# Altium schematic sheet Mini_PD.SchDoc
size A4
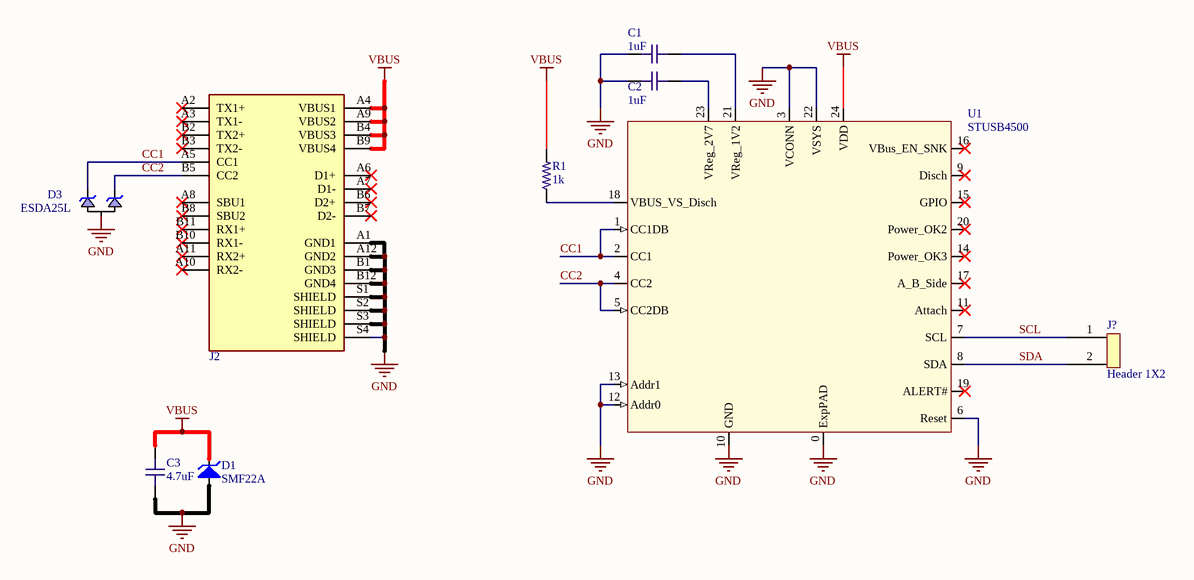
[diagram p0: Mini_PD.SchDoc]

## Parts
C1  value 1uF  [C0402-HIGH-DENSITY]  (hidden comment: C0402 1uF 6.3V X7R)
C2  value 1uF  [C0402-HIGH-DENSITY]  (hidden comment: C0402 1uF 6.3V X7R)
C3  value 4.7uF  [C0603-HIGH-DENSITY]  (hidden comment: 4.7uF, 25V, X5R, 0603)
D1  SMF22A  [SOD-123F]
D3  ESDA25L  [SOT23-3L]
J2  USB C  [Molex USB-C]  (value not drawn)
J?  Header 1X2  [Header 1x2 TH Pitch 2.54mm]
R1  value 1k  [R0402-HIGH-DENSITY]  (hidden comment: R0402 1k 1%)
U1  STUSB4500  [QFN24 - 4X4MM - PITCH 0.5MM - EXPOSEDPAD]

## Nets
GND: C1.1 C2.1 C3.1 D1.A D3.3(A) J2.A1(GND1) J2.A12(GND2) J2.B1(GND3) J2.B12(GND4) J2.S1(SHIELD) J2.S2(SHIELD) J2.S3(SHIELD) J2.S4(SHIELD) U1.0(ExpPAD) U1.3(VCONN) U1.6(Reset) U1.10(GND) U1.12(Addr0) U1.13(Addr1) U1.22(VSYS)
VBUS: C3.2 D1.K J2.A4(VBUS1) J2.A9(VBUS2) J2.B4(VBUS3) J2.B9(VBUS4) R1.2 U1.24(VDD)
CC1: D3.2(K2) J2.A5(CC1) U1.1(CC1DB) U1.2(CC1)
CC2: D3.1(K1) J2.B5(CC2) U1.4(CC2) U1.5(CC2DB)
SCL: J?.1 U1.7(SCL)
SDA: J?.2 U1.8(SDA)
NetC1_2: C1.2 U1.21(VReg_1V2)
NetC2_2: C2.2 U1.23(VReg_2V7)
NetR1_1: R1.1 U1.18(VBUS_VS_Disch)

Not connected (* = marked no-connect by the designer): J2 A2(TX1+)* A3(TX1-)* A6(D1+)* A7(D1-)* A8(SBU1)* A10(RX2-)* A11(RX2+)* B2(TX2+)* B3(TX2-)* B6(D2+)* B7(D2-)* B8(SBU2)* B10(RX1-)* B11(RX1+)*; U1 9(Disch)* 11(Attach)* 14(Power_OK3)* 15(GPIO)* 16(VBus_EN_SNK)* 17(A_B_Side)* 19(ALERT#)* 20(Power_OK2)*

## Library data of the parts
C1 C2 = C0402 1uF 6.3V X7R: Chip Capacitor, 0402, 1uF, 6.3V, X7R; EIA Code: X7R; Max. Voltage: 6.3V; Supplier 1: Digi-Key; Supplier Part Number 1: 490-13339-1-ND
C3 = C0603 4.7uF 25V X5R: Chip Capacitor, 0603, 4.7uF, 25V, X5R; EIA Code: X5R; Max. Voltage: 25V; Supplier 1: Digi-Key; Supplier 2: Mouser; Supplier 3: LCSC; Supplier Part Number 1: 490-7203-1-ND; Supplier Part Number 2: 81-GRM188R61E475KE1D; Supplier Part Number 3: C90057
D1 = SMF22A: Unidirectional 22V 24.4V 35.5V 5.6A SOD-123F TVS RoHS; Manufacturer: Littlefuse Inc.; Manufacturer’s ordering code: SMF22A; Part Number: SMF22A; Value: 24.4V; Supplier 1: Digi-Key; Supplier 2: Mouser; Supplier Part Number 1: F5822CT-ND; Supplier Part Number 2: 576-SMF22A; Supplier 3: LCSC; Supplier Part Number 3: C169431
D3 = ESDA25L: Dual Transil Array For ESD Protection in SOT23-3 Vbr = 25V; Manufacturer: STMicroelectronics; Supplier 1: Digi-Key; Supplier 2: Mouser; Supplier 3: LCSC; Supplier Part Number 1: 497-4642-1-ND; Supplier Part Number 2: 511-ESDA25L; Supplier Part Number 3: C95343; Manufacturer Part Number: ESDA25L
J2 = USB C: USB-C USB 3.1 Gen 2, Superspeed+_ Receptacle Connector 24 Position Surface Mount, Right Angle; Through Hole; MF: Molex; MP: 1054500101; Package: None; Digi-Key_Part_Number: WM12856CT-ND; SnapEDA_Link: https://www.snapeda.com/parts/1054500101/Molex/view-part/448528/?ref=snap; Digi-Key_Purchase_URL: https://www.digikey.tw/product-detail/en/molex/1054500101/WM12856CT-ND/5843891?utm_source=snapeda&utm_medium=aggregator&utm_campaign=symbol; Value: *; Supplier 1: Digi-Key; Supplier 2: Mouser; Supplier 3: LCSC; Supplier Part Number 1: WM12856CT-ND; Supplier Part Number 2: 538-105450-0101; Supplier Part Number 3: C134092
R1 = R0402 1k 1%: Chip Resistor, 0402, 1k ohms, 1%, 1/16 W; Supplier 1: Digi-Key; Supplier Part Number 1: 311-1.00KLRCT-ND
U1 = STUSB4500QTR: Standalone USB PD controller  with SINK auto-run mode in QFN24 4x4mm; Manufacturer: STMicroelectronics; Part Number: Standalone USB PD controller  with SINK auto-run mode in QFN24 4x4mm; Manufacturer’s ordering code: STUSB4500QTR; Value: STUSB4500; Supplier 1: Digi-Key; Supplier 2: Mouser; Supplier Part Number 1: 497-18060-1-ND; Supplier Part Number 2: 511-STUSB4500QTR